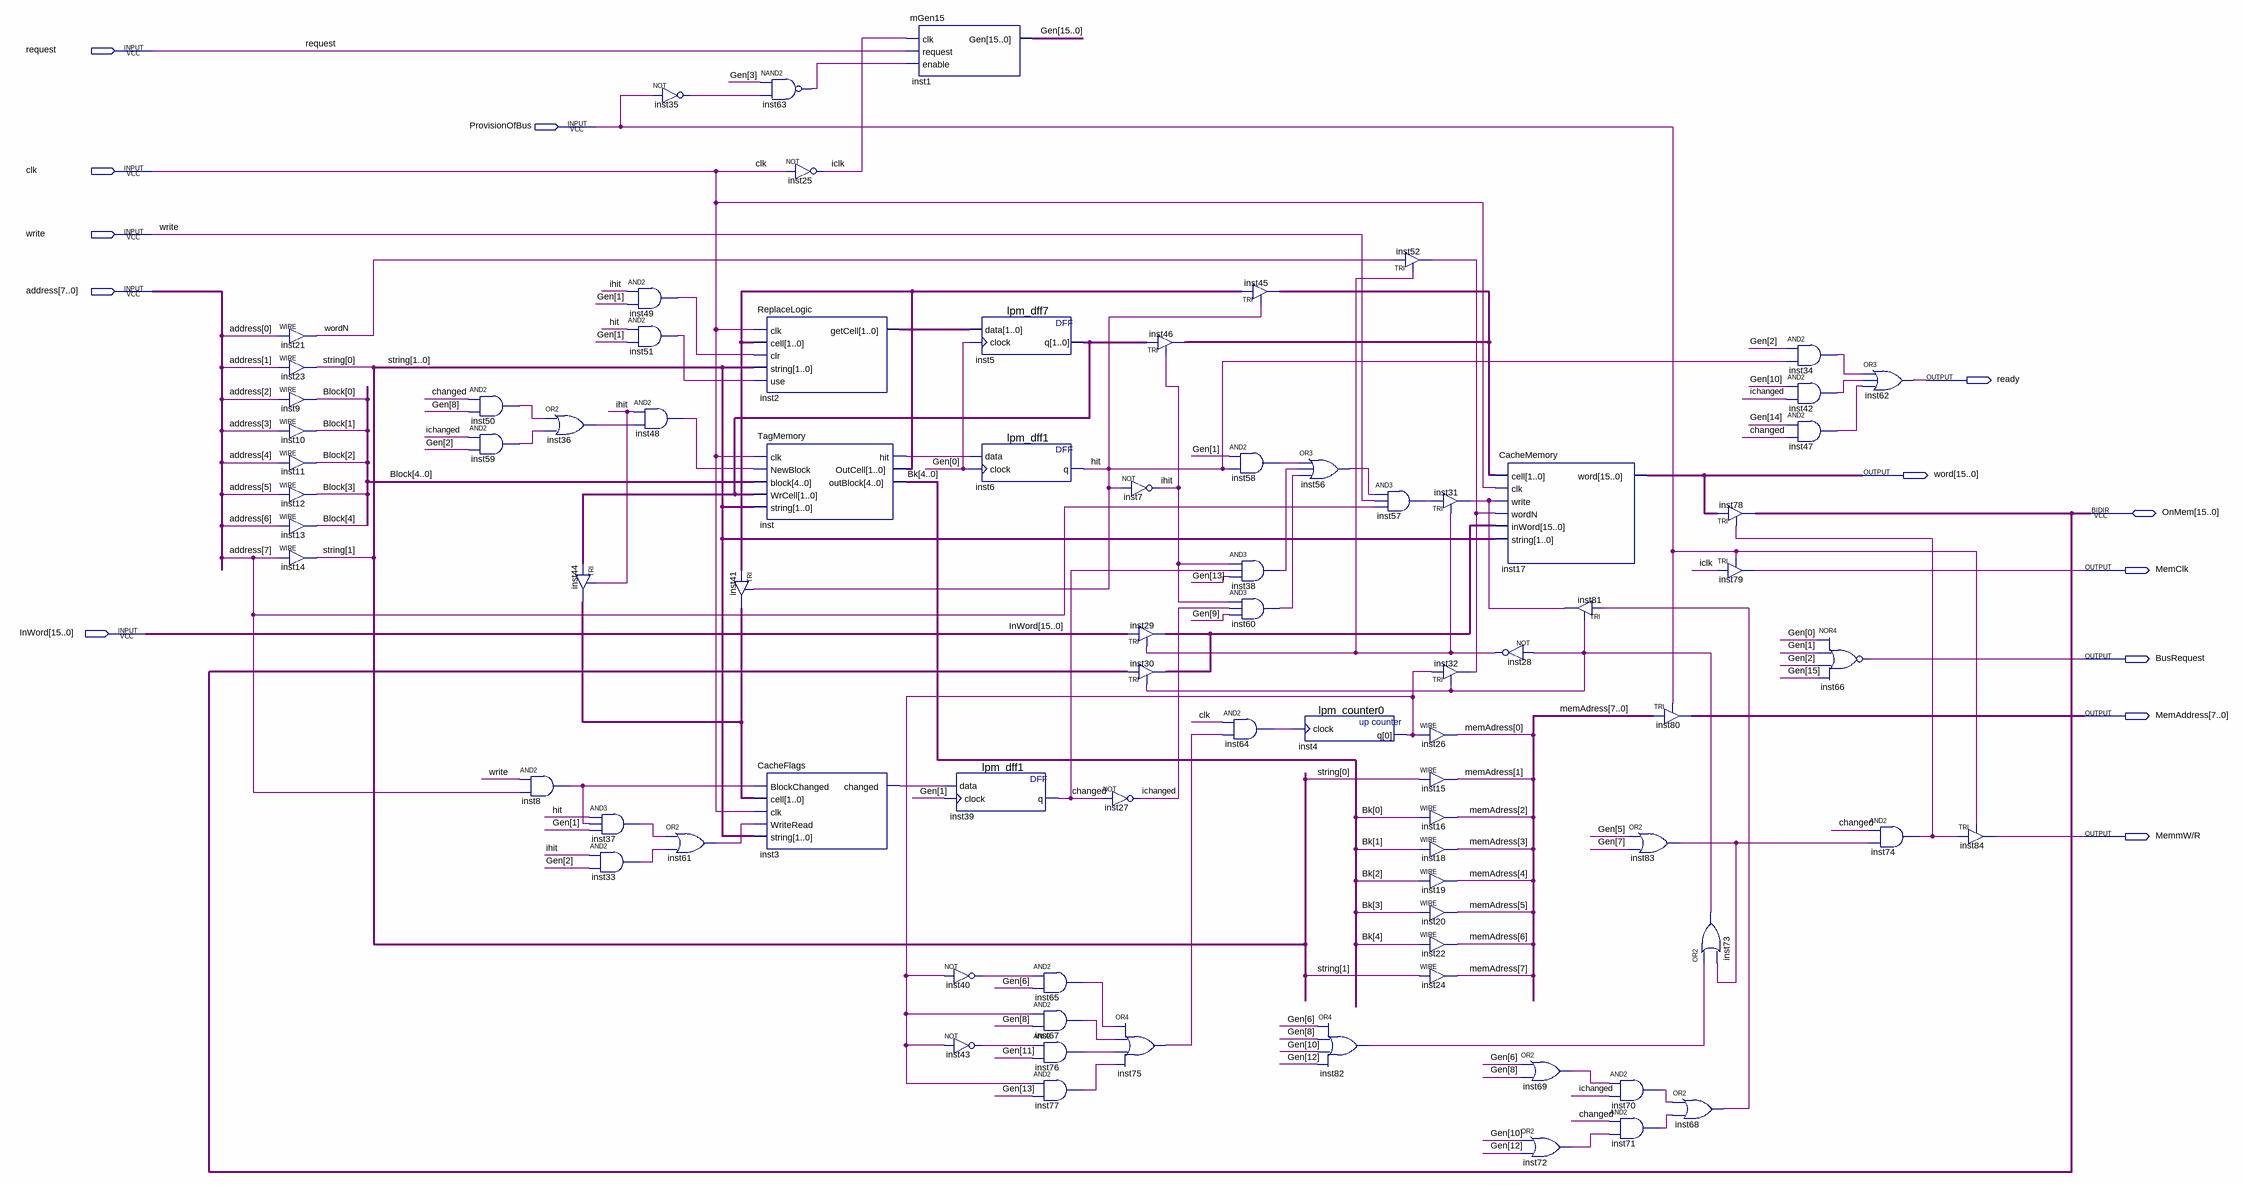
[diagram p0: schematic sheet]
// Quartus schematic cache.bdf as structural Verilog: 82 symbols, 13 pins
module cache (
  input  request,
  input  ProvisionOfBus,
  input  clk,
  input  write,
  input  [7:0] address,
  input  [15:0] InWord,
  inout  [15:0] OnMem,
  output ready,
  output [15:0] word,
  output MemClk,
  output BusRequest,
  output [7:0] MemAddress,
  output \MemmW/R 
);

  wire changed, hit, ichanged, iclk, ihit, inst3_changed, inst4_q, inst8_out, inst28_out, inst31_out,
       inst33_out, inst34_out, inst35_out, inst36_out, inst37_out, inst38_out, inst40_out, inst42_out,
       inst43_out, inst47_out, inst48_out, inst49_out, inst50_out, inst51_out, inst52_out, inst56_out,
       inst57_out, inst58_out, inst59_out, inst60_out, inst61_out, inst63_out, inst64_out, inst65_out,
       inst67_out, inst68_out, inst69_out, inst70_out, inst71_out, inst72_out, inst73_out, inst74_out,
       inst75_out, inst76_out, inst77_out, inst82_out, inst83_out, inst_hit, wordN;
  wire [1:0] inst2_getcell, inst5_q, inst44_out, inst46_out, inst_outcell, \string ;
  wire [4:0] Bk, Block;
  wire [7:0] memAdress;
  wire [15:0] Gen, inst29_out;

  assign wordN = address[0];  // WIRE inst21
  assign \string [0] = address[1];  // WIRE inst23
  assign Block[0] = address[2];  // WIRE inst9
  assign Block[1] = address[3];  // WIRE inst10
  assign Block[2] = address[4];  // WIRE inst11
  assign Block[3] = address[5];  // WIRE inst12
  assign Block[4] = address[6];  // WIRE inst13
  assign \string [1] = address[7];  // WIRE inst14
  and inst50 (inst50_out, changed, Gen[8]);
  and inst59 (inst59_out, ichanged, Gen[2]);
  and inst8 (inst8_out, write, address[7]);
  or inst36 (inst36_out, inst50_out, inst59_out);
  TRI inst44[1:0] (.IN(inst5_q), .OE(ihit), .OUT(inst44_out));
  and inst49 (inst49_out, ihit, Gen[1]);
  and inst51 (inst51_out, hit, Gen[1]);
  and inst37 (inst37_out, hit, inst8_out, Gen[1]);
  and inst33 (inst33_out, ihit, Gen[2]);
  not inst35 (inst35_out, ProvisionOfBus);
  and inst48 (inst48_out, ihit, inst36_out);
  or inst61 (inst61_out, inst37_out, inst33_out);
  TRI inst41[1:0] (.IN(inst_outcell), .OE(hit), .OUT(inst44_out));
  nand inst63 (inst63_out, Gen[3], inst35_out);
  ReplaceLogic inst2 (
    .clk(clk), .\cell (inst_outcell), .clr(inst49_out), .\string (\string ), .\use (inst51_out),
    .getCell(inst2_getcell));
  TagMemory inst (
    .clk(clk), .NewBlock(inst48_out), .block(Block), .WrCell(inst5_q), .\string (\string ), .hit(inst_hit),
    .OutCell(inst_outcell), .outBlock(Bk));
  CacheFlags inst3 (
    .BlockChanged(inst8_out), .\cell (inst44_out), .clk(clk), .WriteRead(inst61_out), .\string (\string ),
    .changed(inst3_changed));
  not inst25 (iclk, clk);
  mGen15 inst1 (.clk(iclk), .request(request), .enable(inst63_out), .Gen(Gen));
  lpm_dff7 inst5 (.data(inst2_getcell), .clock(Gen[0]), .q(inst5_q));
  lpm_dff1 inst6 (.data(inst_hit), .clock(Gen[0]), .q(hit));
  lpm_dff1 inst39 (.data(inst3_changed), .clock(Gen[1]), .q(changed));
  not inst40 (inst40_out, inst4_q);
  not inst43 (inst43_out, inst4_q);
  and inst65 (inst65_out, inst40_out, Gen[6]);
  and inst67 (inst67_out, inst4_q, Gen[8]);
  and inst76 (inst76_out, inst43_out, Gen[11]);
  and inst77 (inst77_out, inst4_q, Gen[13]);
  not inst7 (ihit, hit);
  TRI inst29[15:0] (.IN(InWord), .OE(inst28_out), .OUT(inst29_out));
  TRI inst30[15:0] (.IN(OnMem), .OE(inst73_out), .OUT(inst29_out));
  not inst27 (ichanged, changed);
  or inst75 (inst75_out, inst65_out, inst67_out, inst76_out, inst77_out);
  TRI inst46[1:0] (.IN(inst5_q), .OE(ihit), .OUT(inst46_out));
  and inst58 (inst58_out, Gen[1], hit);
  and inst38 (inst38_out, ihit, changed, Gen[13]);
  and inst60 (inst60_out, ihit, ichanged, Gen[9]);
  and inst64 (inst64_out, clk, inst75_out);
  TRI inst45[1:0] (.IN(inst_outcell), .OE(hit), .OUT(inst46_out));
  or inst56 (inst56_out, inst58_out, inst38_out, inst60_out);
  lpm_counter0 inst4 (.clock(inst64_out), .q(inst4_q));
  or inst82 (inst82_out, Gen[6], Gen[8], Gen[10], Gen[12]);
  and inst57 (inst57_out, inst56_out, write, address[7]);
  TRI inst52 (.IN(wordN), .OE(inst28_out), .OUT(inst52_out));
  TRI inst31 (.IN(inst57_out), .OE(inst28_out), .OUT(inst31_out));
  TRI inst32 (.IN(inst4_q), .OE(inst73_out), .OUT(inst52_out));
  assign memAdress[0] = inst4_q;  // WIRE inst26
  assign memAdress[1] = \string [0];  // WIRE inst15
  assign memAdress[2] = Bk[0];  // WIRE inst16
  assign memAdress[3] = Bk[1];  // WIRE inst18
  assign memAdress[4] = Bk[2];  // WIRE inst19
  assign memAdress[5] = Bk[3];  // WIRE inst20
  assign memAdress[6] = Bk[4];  // WIRE inst22
  assign memAdress[7] = \string [1];  // WIRE inst24
  CacheMemory inst17 (
    .\cell (inst46_out), .clk(clk), .write(inst31_out), .wordN(inst52_out), .inWord(inst29_out),
    .\string (\string ), .word(word));
  not inst28 (inst28_out, inst73_out);
  or inst69 (inst69_out, Gen[6], Gen[8]);
  or inst72 (inst72_out, Gen[10], Gen[12]);
  TRI inst81 (.IN(inst68_out), .OE(inst73_out), .OUT(inst31_out));
  or inst83 (inst83_out, Gen[5], Gen[7]);
  and inst70 (inst70_out, inst69_out, ichanged);
  and inst71 (inst71_out, changed, inst72_out);
  TRI inst80[7:0] (.IN(memAdress), .OE(ProvisionOfBus), .OUT(MemAddress));
  or inst73 (inst73_out, inst82_out, inst83_out);
  or inst68 (inst68_out, inst70_out, inst71_out);
  TRI inst78[15:0] (.IN(word), .OE(inst74_out), .OUT(OnMem));
  TRI inst79 (.IN(iclk), .OE(ProvisionOfBus), .OUT(MemClk));
  and inst34 (inst34_out, Gen[2], hit);
  and inst42 (inst42_out, Gen[10], ichanged);
  and inst47 (inst47_out, Gen[14], changed);
  nor inst66 (BusRequest, Gen[0], Gen[1], Gen[2], Gen[15]);
  or inst62 (ready, inst34_out, inst42_out, inst47_out);
  and inst74 (inst74_out, changed, inst83_out);
  TRI inst84 (.IN(inst74_out), .OE(ProvisionOfBus), .OUT(\MemmW/R ));
endmodule
